# EasyEDA Pro project YiYiClock.eprj

# Schematic Schematic1
Create Date: 2024-08-25; Page Name: P1; Project Name: YiYiClock; Schematic Name: Schematic1; Update Date: 2024-08-25; Company: 嘉立创EDA; Page Size: A4; Version: V1.0
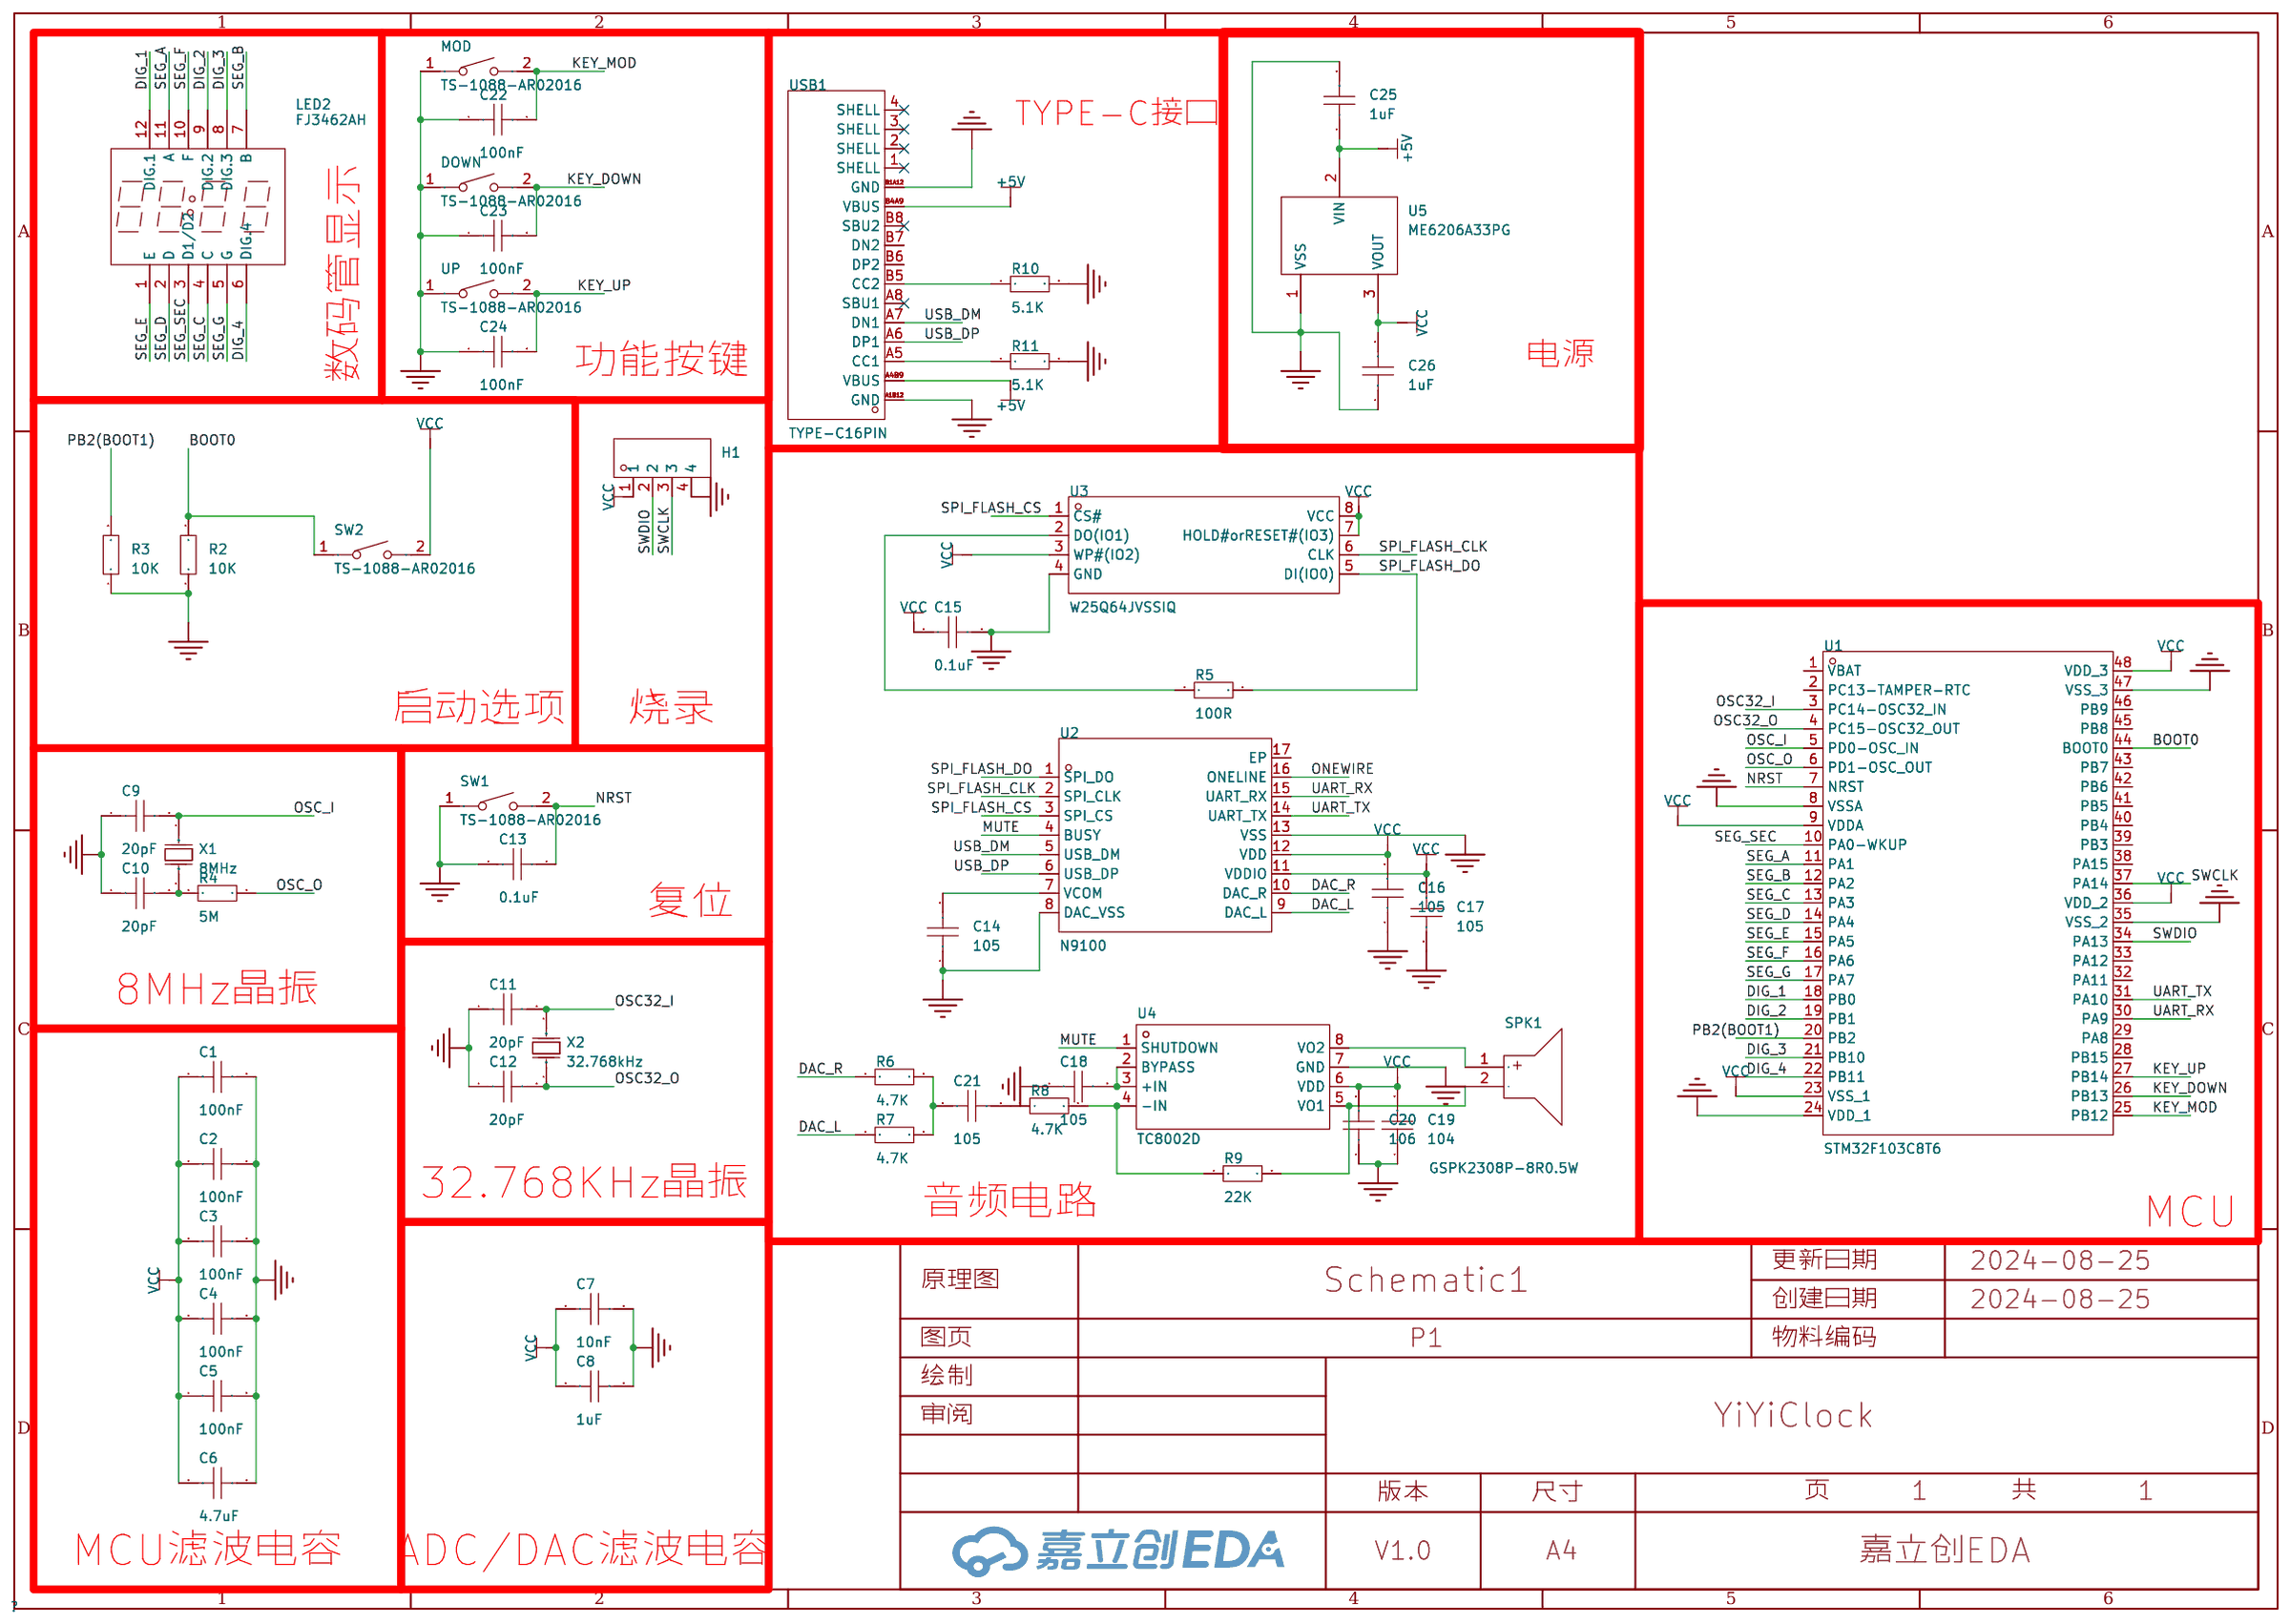
[diagram p0: schematic sheet]

## Parts
C1  100nF  [C0805]
C2  100nF  [C0805]
C3  100nF  [C0805]
C4  100nF  [C0805]
C5  100nF  [C0805]
C6  4.7uF  [C0805]
C7  10nF  [C0805]
C8  1uF  [C0805]
C9  20pF  [C0805]
C10  20pF  [C0805]
C11  20pF  [C0805]
C12  20pF  [C0805]
C13  0.1uF  [C0805]
C14  105  [C0805]
C15  0.1uF  [C0805]
C16  105  [C0805]
C17  105  [C0805]
C18  105  [C0805]
C19  104  [C0805]
C20  106  [C0805]
C21  105  [C0805]
C22  100nF  [C0805]
C23  100nF  [C0805]
C24  100nF  [C0805]
C25  1uF  [res-th_l7.5-w2.3-p4.30-d0.6]
C26  1uF  [res-th_l7.5-w2.3-p4.30-d0.6]
DOWN  TS-1088-AR02016  [SW-SMD_L3.9-W3.0-P4.45]
H1  -  [HDR-TH_4P-P2.54-V-M]
LED2  FJ3462AH  [LED-SEG-TH_12P-L30.0-W14.0-P2.54-S10.16-BL_FJ3462XH]
MOD  TS-1088-AR02016  [SW-SMD_L3.9-W3.0-P4.45]
R2  10K  [res-th_bd2.7-l6.2-p10.20-d0.4]
R3  10K  [res-th_bd2.7-l6.2-p10.20-d0.4]
R4  5M  [R0805]
R5  100R  [R0805]
R6  4.7K  [R0805]
R7  4.7K  [R0805]
R8  4.7K  [R0805]
R9  22K  [R0805]
R10  5.1K  [R0805]
R11  5.1K  [R0805]
SPK1  GSPK2308P-8R0.5W  [SPK-TH_BD23.0-P10.00-D0.8-L-RD]
SW1  TS-1088-AR02016  [SW-SMD_L3.9-W3.0-P4.45]
SW2  TS-1088-AR02016  [SW-SMD_L3.9-W3.0-P4.45]
U1  STM32F103C8T6  [LQFP-48_L7.0-W7.0-P0.50-LS9.0-BL]
U2  N9100  [ESOP-16_L9.9-W3.9-P1.27-LS6.0-BL-EP-1]
U3  W25Q64JVSSIQ  [SOIC-8_L5.3-W5.3-P1.27-LS8.0-BL]
U4  TC8002D  [SOIC-8_L5.0-W4.0-P1.27-LS6.0-BL]
U5  ME6206A33PG  [SOT-89-3_L4.5-W2.5-P1.50-LS4.2-BR]
UP  TS-1088-AR02016  [SW-SMD_L3.9-W3.0-P4.45]
USB1  TYPE-C16PIN  [USB-C-SMD_TYPE-C16PIN]
X1  8MHz  [CRYSTAL-SMD_L11.5-W4.8-LS12.7]
X2  32.768kHz  [OSC-SMD_L3.2-W1.5]

## Library data of the parts
C1-C24 = CAP_0805: Supplier Footprint: 0805
C25 C26 = CAP_0603: Supplier Footprint: 0603
DOWN MOD SW1 SW2 UP = TS-1088-AR02016: 电路结构:单刀单掷;按钮形状:圆形按钮;作用力:160gf;安装方式:立贴;开关长度:4mm;开关宽度:3mm;开关高度:2mm;带支架:不带;触点电流:50mA;额定电压(DC):12V;绝缘电阻:100MΩ;机械寿命:10万次;; LCSC Part Name: 4*3*2mm 立贴 轻触开关; Supplier Part: C720477; Manufacturer: XUNPU(讯普); Supplier Footprint: SMD; JLCPCB Part Class: 扩展库; Datasheet: https://atta.szlcsc.com/upload/public/pdf/source/20200810/C720475_60D09DD6C54279ADDB2DC25100F1CC11.pdf; Supplier: LCSC; Circuit: 单刀单掷; Actuator Style: 圆形按钮; Operating Force: 160gf; Mounting Style: 立贴; Switch Length: 4mm; Switch Width: 3mm; Switch Height: 2mm; Strike Gundam: 不带; Contact Current: 50mA; Voltage Rating (DC): 12V; Insulation Resistance: 100MΩ; Actuator/Cap Color: 黑色; Pin Style: SMD接片; Mechanical Life: 10万次; Operating Temperature: -30℃~+80℃
H1 = HDR-M_2.54_1x4P: Supplier Part: C492403; Supplier Footprint: 插件
LED2 = FJ3462AH: 发光颜色:-;; Supplier Part: C528072; Manufacturer: 志浩; Supplier Footprint: 插件; JLCPCB Part Class: 扩展库; Datasheet: https://atta.szlcsc.com/upload/public/pdf/source/20200714/C528072_875739C91E3D1B8CE3F89DB3AB3C45A9.pdf; Supplier: LCSC
R2 R3 = Res_0603: Supplier Footprint: 0603
R4-R11 = Res_0805: Supplier Footprint: 0805
SPK1 = GSPK2308P-8R0.5W: Supplier Part: C530532; Manufacturer: INGHAi(赢海); JLCPCB Part Class: 扩展库; Datasheet: https://atta.szlcsc.com/upload/public/pdf/source/20200723/C530532_3DB1F973601B36F20FBCCA52751811A3.pdf; Supplier: LCSC
U1 = STM32F103C8T6: CPU内核:ARM-M3;程序存储容量:64KB;RAM总容量:20KB;GPIO端口数量:37;工作电压范围:2V~3.6V;CPU最大主频:72MHz;程序存储器类型:FLASH;; LCSC Part Name: 主流增强型ARM Cortex-M3 MCU，具有64 KB Flash、72 MHz CPU、电机控制、USB和CAN; Supplier Part: C8734; Manufacturer: ST(意法半导体); Supplier Footprint: LQFP-48(7x7); JLCPCB Part Class: 扩展库; Datasheet: https://atta.szlcsc.com/upload/public/pdf/source/20220812/8363ACEC51AD55ECEB84799464F7CB85.pdf; Supplier: LCSC; CPU Core: ARM-M3; Program Storage Size: 64KB; RAM Size: 20KB; GPIO Ports Number: 37; Operating Voltage Range: 2V~3.6V; CPU Maximum Speed: 72MHz; Program Memory Type: FLASH; Operating Temperature Range: -40℃~+85℃; ADC (Bit): 12bit; Universal Serial Bus: 有; Peripheral/Function: 看门狗；DMA；看门狗；温度传感器; Watchdog: 有; Infrared Data Association: 有; Low-Voltage Detect: 有; Direct Memory Access: 有; Internal Oscillator: 有
U2 = N9100: 类型:处理器;接口:串行;采样频率:4kHz~48kHz;; LCSC Part Name: 音频解码芯片N9100; Supplier Part: C5186932; Manufacturer: NINE CIHP(九芯电子); Supplier Footprint: SOP-16-150mil; JLCPCB Part Class: 扩展库; Datasheet: https://atta.szlcsc.com/upload/public/pdf/source/20230313/ACBEE4CC81010E530B92D02B5D1A680A.pdf; Supplier: LCSC; Type: 处理器; Interface: 串行; Sampling Frequency: 4kHz~48kHz; Supply Voltage: 3V~5V; Operating Temperature: -20℃~+80℃
U3 = W25Q64JVSSIQ: Supplier Part: C179171; Manufacturer: WINBOND(华邦); Supplier Footprint: SOIC-8-208mil; JLCPCB Part Class: 扩展库; Datasheet: https://atta.szlcsc.com/upload/public/pdf/source/20191218/C179171_92C5C91D0324539EDD8F1160D2E79C0F.pdf; Supplier: LCSC
U4 = TC8002D: 功放类型:-;扬声器通道数:单声道;输出功率:3Wx1@3Ω;; Supplier Part: C87265; Manufacturer: FM(富满); Supplier Footprint: SOIC-8; JLCPCB Part Class: 扩展库; Datasheet: https://atta.szlcsc.com/upload/public/pdf/source/20161123/1479873101876.pdf; Supplier: LCSC; Speaker Channels: 单声道; Output Power: 3Wx1@3Ω; Supply Voltage: 2V~5.5V
U5 = ME6206A33PG: 输出类型:固定;最大输入电压:6V;输出电压:3.3V;最大输出电流:300mA;电源纹波抑制比(PSRR):50dB@(1kHz);输出极性:正极;; LCSC Part Name: 输入6V 输出3.3V 300mA; Supplier Part: C79022; Manufacturer: MICRONE(南京微盟); Supplier Footprint: SOT-89-3; JLCPCB Part Class: 扩展库; Datasheet: https://atta.szlcsc.com/upload/public/pdf/source/20160727/1469591428238.pdf; Supplier: LCSC; Output Type: 固定; Maximum Input Voltage: 6V; Output Voltage: 3.3V; MAX Output Current: 300mA; Power Supply Rejection Ratio (PSRR): 50dB@(1kHz); Dropout Voltage: 380mV@(200mA); Output Polarity: 正极; Number of Outputs: 1
USB1 = TYPE-C16PIN: 连接器类型:Type-C;标准:-;公母:母;端口数量:1;触点数量:16P;安装方式:卧贴;额定电流 - 电源:3A;工作温度范围:-40℃~+85℃;; LCSC Part Name: Type-C 母 卧贴; Supplier Part: C393939; Manufacturer: SHOU HAN(首韩); Supplier Footprint: SMD; JLCPCB Part Class: 扩展库; Datasheet: https://atta.szlcsc.com/upload/public/pdf/source/20190521/C393939_7B9043D4CF1026AF443AB60D91FBCD5C.pdf; Supplier: LCSC; Connector Type: Type-C; Gender: 母; Number of Ports: 1; Number of Contacts: 16P; Mounting Style: 卧贴; Current Rating - Power (Max): 3A; Operating Temperature Range: -40℃~+85℃
X1 = X49SM8MSD2SC: 晶振类型:贴片晶振;频率:8MHz;常温频差:±20ppm;外接负载电容:20pF;频率稳定度(全温):±30ppm;; LCSC Part Name: 8MHz ±20ppm 20pF; Supplier Part: C12674; Manufacturer: YXC(扬兴晶振); Supplier Footprint: HC-49S-SMD; JLCPCB Part Class: 基础库; Datasheet: https://atta.szlcsc.com/upload/public/pdf/source/20240329/3EBF42EBCAB50CA65B6FA9D7CFA1955A.pdf; Supplier: LCSC; Crystal Type: 贴片晶振; Normal temperature Frequency Tolerance: ±20ppm; External load capacitor: 20pF; Frequency Stability(Full temperature range): ±30ppm; Operating Temperature: -20℃~+70℃
X2 = TCXM32768K2NGDCZT2T: 晶振类型:贴片晶振;频率:32.768kHz;常温频差:±20ppm;外接负载电容:12.5pF;; LCSC Part Name: 32.768kHz ±20ppm 12.5pF; Supplier Part: C145167; Manufacturer: YJX(雅晶鑫); Supplier Footprint: SMD3215-2P; JLCPCB Part Class: 扩展库; Datasheet: https://atta.szlcsc.com/upload/public/pdf/source/20210824/1A405723E33C130357A85314F3997F53.pdf; Supplier: LCSC; Crystal Type: 贴片晶振; Normal temperature Frequency Tolerance: ±20ppm; External load capacitor: 12.5pF; Equivalent Series Resistance (ESR): 80kΩ; Operating Temperature: -40℃~+85℃

## Nets
+5V: C25.1 U5.2(VIN) USB1.A4B9(VBUS) USB1.B4A9(VBUS)
GND: C1.2 C2.2 C3.2 C4.2 C5.2 C6.2 C7.2 C8.2 C9.1 C10.1 C11.1 C12.1 C13.1 C14.1 C15.2 C16.1 C17.1 C18.1 C19.1 C20.1 C22.1 C23.1 C24.1 C25.2 C26.1 DOWN.1 H1.4 MOD.1 R2.1 R3.1 R10.2 R11.2 SW1.1 U1.8(VSSA) U1.24(VDD_1) U1.35(VSS_2) U1.47(VSS_3) U2.8(DAC_VSS) U2.13(VSS) U3.4(GND) U4.7(GND) U5.1(VSS) UP.1 USB1.A1B12(GND) USB1.B1A12(GND)
VCC: C1.1 C2.1 C3.1 C4.1 C5.1 C6.1 C7.1 C8.1 C15.1 C16.2 C17.2 C19.2 C20.2 C26.2 H1.1 SW2.2 U1.9(VDDA) U1.23(VSS_1) U1.36(VDD_2) U1.48(VDD_3) U2.11(VDDIO) U2.12(VDD) U3.3(WP#(IO2)) U3.7(HOLD#orRESET#(IO3)) U3.8(VCC) U4.6(VDD) U5.3(VOUT)
BOOT0: R2.2 SW2.1 U1.44(BOOT0)
DAC_L: R7.1 U2.9(DAC_L)
DAC_R: R6.1 U2.10(DAC_R)
DIG_1: LED2.12(DIG.1) U1.18(PB0)
DIG_2: LED2.9(DIG.2) U1.19(PB1)
DIG_3: LED2.8(DIG.3) U1.21(PB10)
DIG_4: LED2.6(DIG.4) U1.22(PB11)
KEY_DOWN: C23.2 DOWN.2 U1.26(PB13)
KEY_MOD: C22.2 MOD.2 U1.25(PB12)
KEY_UP: C24.2 U1.27(PB14) UP.2
MUTE: U2.4(BUSY) U4.1(SHUTDOWN)
NRST: C13.2 SW1.2 U1.7(NRST)
ONEWIRE: U2.16(ONELINE)
OSC32_I: C11.2 U1.3(PC14-OSC32_IN) X2.2(OSC2)
OSC32_O: C12.2 U1.4(PC15-OSC32_OUT) X2.1(OSC1)
OSC_I: C9.2 U1.5(PD0-OSC_IN) X1.1(OSC1)
OSC_O: R4.2 U1.6(PD1-OSC_OUT)
PB2(BOOT1): R3.2 U1.20(PB2)
SEG_A: LED2.11(A) U1.11(PA1)
SEG_B: LED2.7(B) U1.12(PA2)
SEG_C: LED2.4(C) U1.13(PA3)
SEG_D: LED2.2(D) U1.14(PA4)
SEG_E: LED2.1(E) U1.15(PA5)
SEG_F: LED2.10(F) U1.16(PA6)
SEG_G: LED2.5(G) U1.17(PA7)
SEG_SEC: LED2.3(D1/D2) U1.10(PA0-WKUP)
SPI_FLASH_CLK: U2.2(SPI_CLK) U3.6(CLK)
SPI_FLASH_CS: U2.3(SPI_CS) U3.1(CS#)
SPI_FLASH_DO: R5.2 U2.1(SPI_DO) U3.5(DI(IO0))
SWCLK: H1.3 U1.37(PA14)
SWDIO: H1.2 U1.34(PA13)
UART_RX: U1.30(PA9) U2.15(UART_RX)
UART_TX: U1.31(PA10) U2.14(UART_TX)
USB_DM: U2.5(USB_DM) USB1.A7(DN1)
USB_DP: U2.6(USB_DP) USB1.A6(DP1)
$1N1263: C10.2 R4.1 X1.2(OSC2)
$1N2404: C14.2 U2.7(VCOM)
$1N2703: R5.1 U3.2(DO(IO1))
$1N2909: C18.2 U4.2(BYPASS) U4.3(+IN)
$1N2993: SPK1.1(+) U4.8(VO2)
$1N3219: C21.1 R6.2 R7.2
$1N3294: C21.2 R8.1
$1N3349: R8.2 R9.1 U4.4(-IN)
$1N3354: R9.2 SPK1.2(-) U4.5(VO1)
$1N4394: R10.1 USB1.B5(CC2)
$1N4449: R11.1 USB1.A5(CC1)

Not connected (* = marked no-connect by the designer): U1 1(VBAT) 2(PC13-TAMPER-RTC) 28(PB15) 29(PA8) 32(PA11) 33(PA12) 38(PA15) 39(PB3) 40(PB4) 41(PB5) 42(PB6) 43(PB7) 45(PB8) 46(PB9); U2 17(EP); USB1 1(SHELL)* 2(SHELL)* 3(SHELL)* 4(SHELL)* A8(SBU1)* B6(DP2) B7(DN2) B8(SBU2)*

## Notes on the sheet
- TYPE-C接口
- 数码管显示
- 功能按键
- 电源
- 启动选项
- 烧录
- 复位
- 8MHz晶振
- 32.768KHz晶振
- 音频电路
- MCU
- MCU滤波电容
- ADC/DAC滤波电容

# Board PCB1
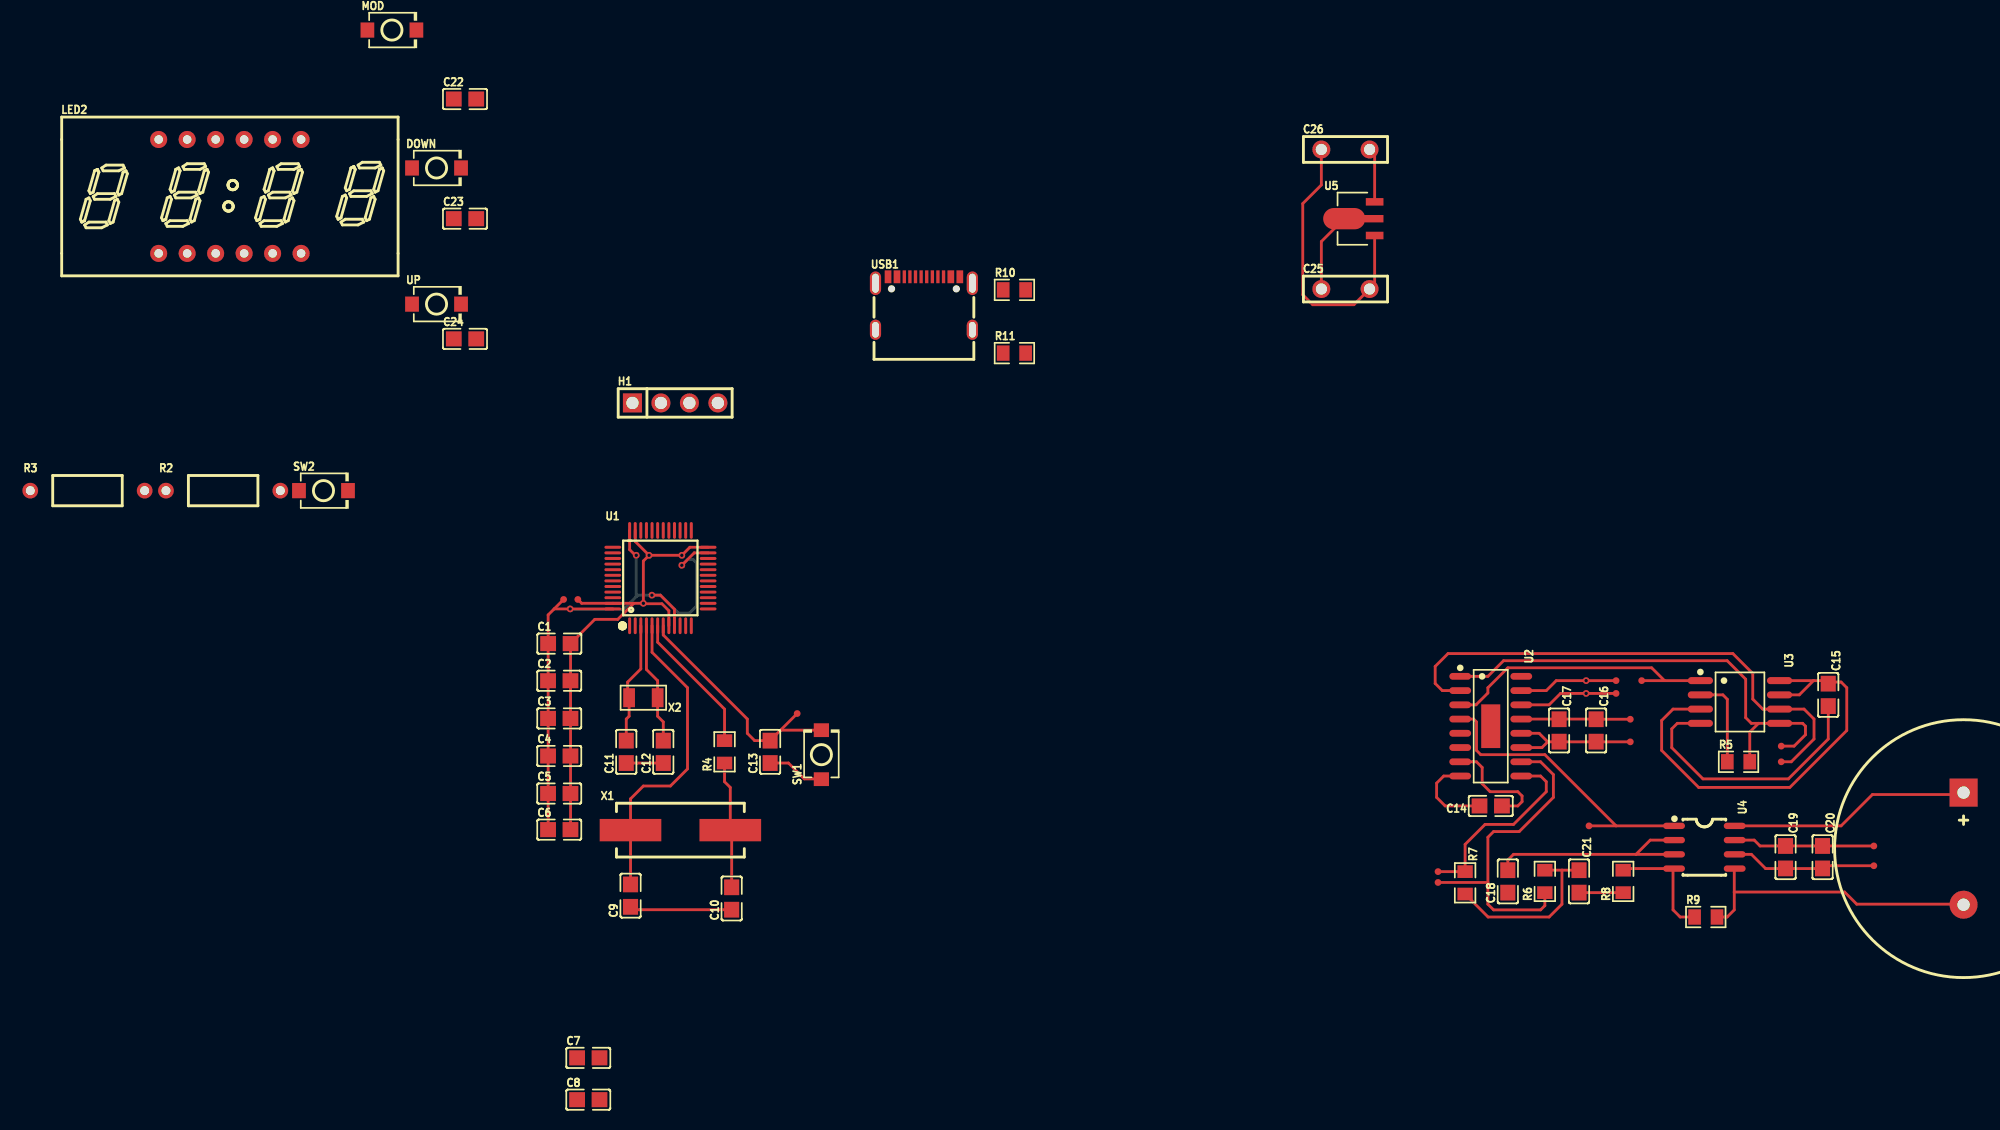
[diagram p1: board, top side]
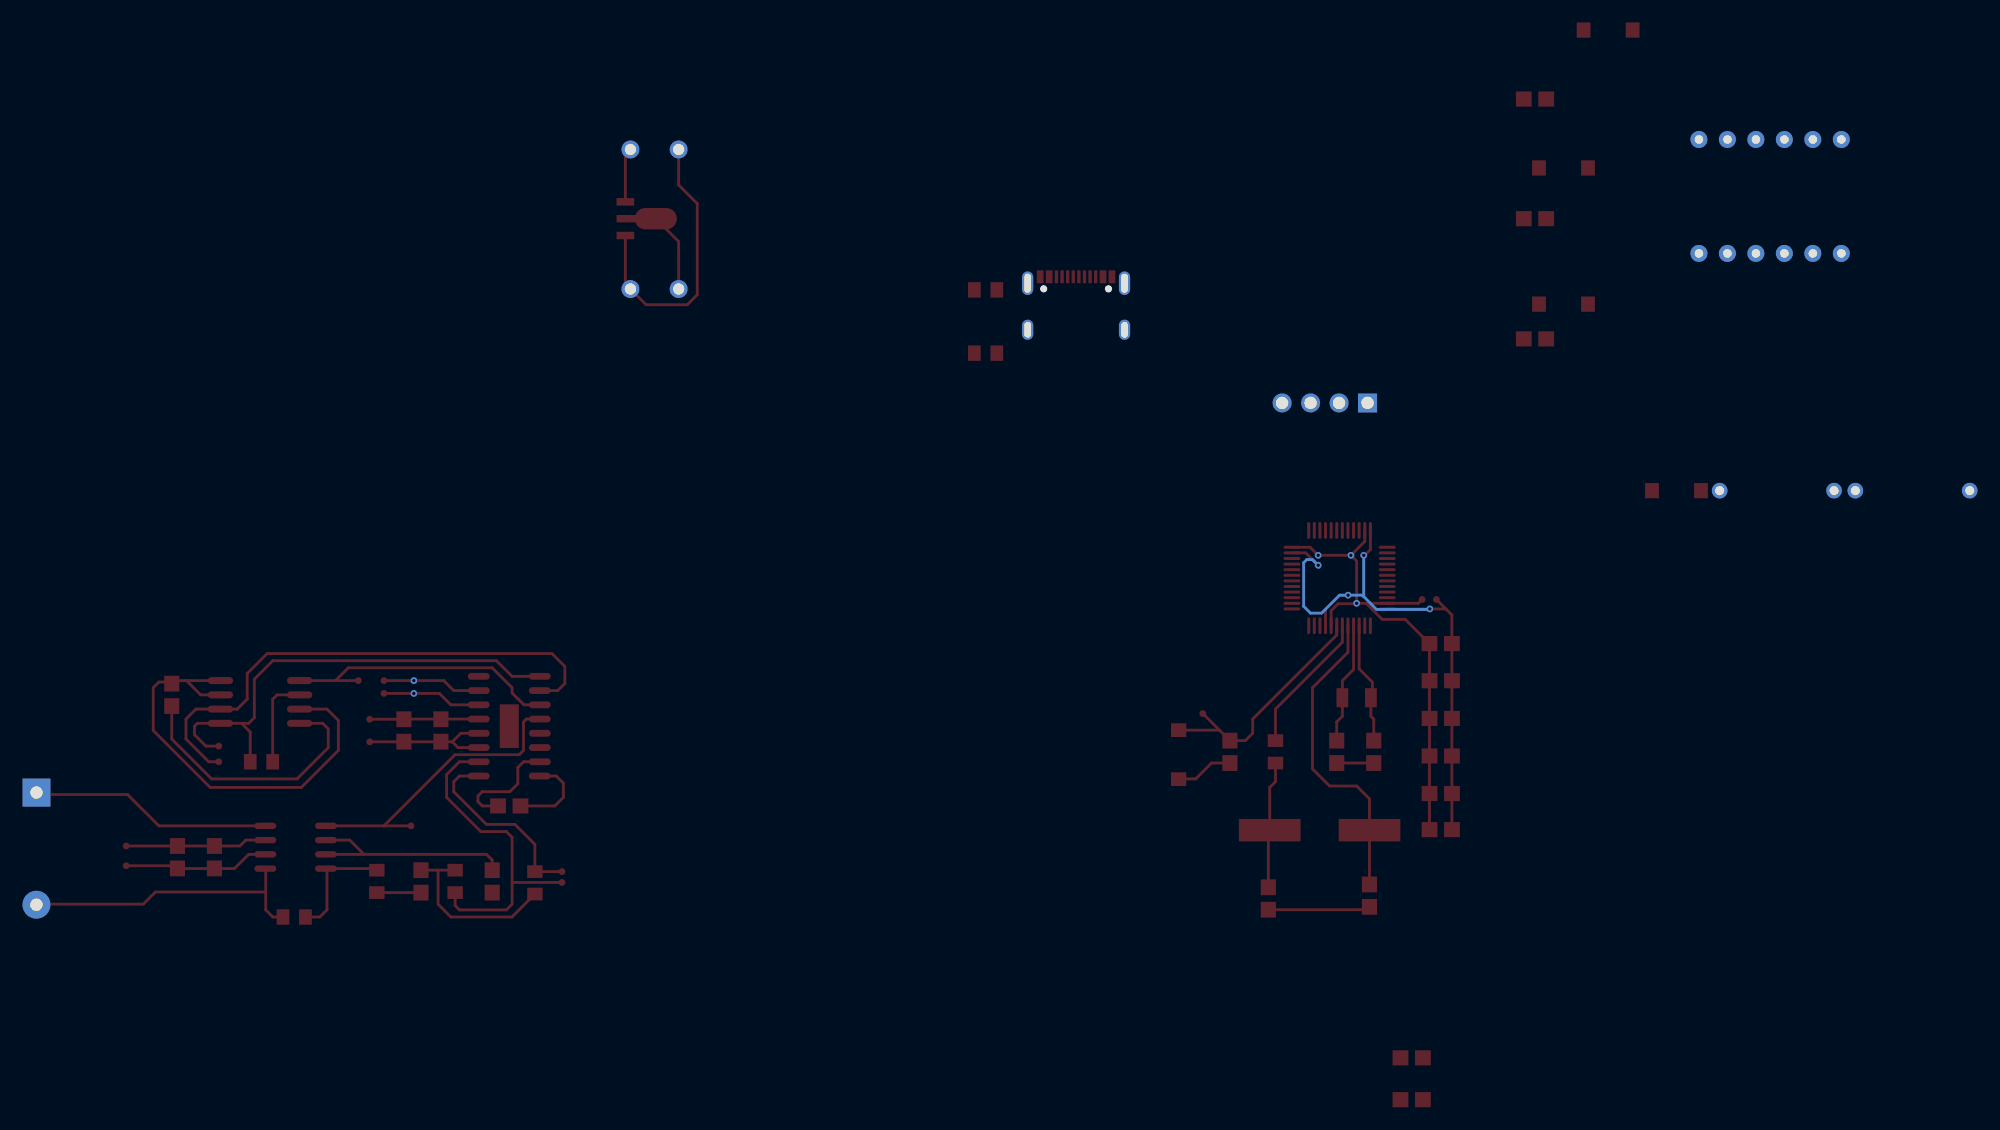
[diagram p2: board, bottom side, seen from below]

Outline 6.42 x 0.64 mm; copper layers: Top Layer, Bottom Layer. Coordinates in mm from the lower left corner of the outline.
Stack: Top Layer 0.035mm / Dielectric1 1.51mm FR4 er 4.5 / Bottom Layer 0.035mm

## Design rules (mm)
template: JLCPCB Capability(Two Layers Board)
spacing copperThickness1oz (default): track to track 0.102, other pairs 0.152 to 0.3
spacing copperThickness2oz: track to track 0.203, other pairs 0.152 to 0.3
track width copperThickness1oz (default): min 0.127, default 0.254, max 2.54
track width copperThickness2oz: min 0.203, default 0.254, max 2.54
differential pair differentialPair (default): width min 0.127, default 0.254, max 2.54; gap min 0.152, default 0.152
via viaSize (default): diameter min 0.5, default 0.61, max 10; hole min 0.3, default 0.305, max 6.3

## Placement (name value [footprint] x y rotation side)
C1  100nF  [C0805]  -29.3 -31.32 0 top
C2  100nF  [C0805]  -29.31 -34.63 0 top
C3  100nF  [C0805]  -29.31 -37.99 0 top
C4  100nF  [C0805]  -29.31 -41.34 0 top
C5  100nF  [C0805]  -29.31 -44.69 0 top
C6  4.7uF  [C0805]  -29.31 -47.91 0 top
C7  10nF  [C0805]  -26.72 -68.26 0 top
C8  1uF  [C0805]  -26.72 -71.99 0 top
C9  20pF  [C0805]  -22.95 -53.8 90 top
C10  20pF  [C0805]  -13.93 -54.05 90 top
C11  20pF  [C0805]  -23.33 -40.97 90 top
C12  20pF  [C0805]  -20.03 -40.97 90 top
C13  0.1uF  [C0805]  -10.5 -40.97 90 top
C14  105  [C0805]  53.76 -45.8 0 top
C15  0.1uF  [C0805]  83.86 -35.89 270 top
C16  105  [C0805]  63.16 -39.07 270 top
C17  105  [C0805]  59.85 -39.07 270 top
C18  105  [C0805]  55.28 -52.53 90 top
C19  104  [C0805]  80.05 -50.37 270 top
C20  106  [C0805]  83.35 -50.37 270 top
C21  105  [C0805]  61.63 -52.53 270 top
C22  100nF  [C0805]  -37.71 17.25 0 top
C23  100nF  [C0805]  -37.71 6.58 0 top
C24  100nF  [C0805]  -37.71 -4.14 0 top
C25  1uF  [res-th_l7.5-w2.3-p4.30-d0.6]  40.8 0.3 0 top
C26  1uF  [res-th_l7.5-w2.3-p4.30-d0.6]  40.8 12.75 0 top
DOWN  TS-1088-AR02016  [SW-SMD_L3.9-W3.0-P4.45]  -40.25 11.1 0 top
H1  -  [HDR-TH_4P-P2.54-V-M]  -18.97 -9.85 0 top
LED2  FJ3462AH  [LED-SEG-TH_12P-L30.0-W14.0-P2.54-S10.16-BL_FJ3462XH]  -58.68 8.56 0 top
MOD  TS-1088-AR02016  [SW-SMD_L3.9-W3.0-P4.45]  -44.23 23.4 0 top
NOREF  -  [Pad_e541]  62.52 -47.57 0 top
NOREF#2  -  [Pad_e490]  79.67 -41.86 0 top
NOREF#3  -  [Pad_e549]  49.06 -51.65 0 top
NOREF#4  -  [Pad_e465]  67.22 -34.62 0 top
NOREF#5  -  [Pad_e460]  66.2 -38.07 0 top
NOREF#6  -  [Pad_e687]  -28.92 -27.38 0 top
NOREF#7  -  [Pad_e683]  -27.65 -27.38 0 top
NOREF#8  -  [Pad_e645]  -8.09 -37.56 0 top
NOREF#9  -  [Pad_e461]  66.2 -40.08 0 top
NOREF#10  -  [Pad_e452]  64.93 -34.62 0 top
NOREF#11  -  [Pad_e489]  79.67 -40.46 0 top
NOREF#12  -  [Pad_e454]  64.93 -35.76 0 top
NOREF#13  -  [Pad_e505]  87.92 -49.37 0 top
NOREF#14  -  [Pad_e550]  49.06 -52.62 0 top
NOREF#15  -  [Pad_e506]  87.92 -51.13 0 top
R2  10K  [res-th_bd2.7-l6.2-p10.20-d0.4]  -59.28 -17.68 0 top
R3  10K  [res-th_bd2.7-l6.2-p10.20-d0.4]  -71.38 -17.68 0 top
R4  5M  [R0805]  -14.57 -40.97 90 top
R5  100R  [R0805]  75.86 -41.86 0 top
R6  4.7K  [R0805]  58.58 -52.53 90 top
R7  4.7K  [R0805]  51.47 -52.65 270 top
R8  4.7K  [R0805]  65.57 -52.53 90 top
R9  22K  [R0805]  72.94 -55.7 0 top
R10  5.1K  [R0805]  11.28 0.23 0 top
R11  5.1K  [R0805]  11.28 -5.41 0 top
SPK1  GSPK2308P-8R0.5W  [SPK-TH_BD23.0-P10.00-D0.8-L-RD]  95.92 -49.61 270 top
SW1  TS-1088-AR02016  [SW-SMD_L3.9-W3.0-P4.45]  -5.93 -41.22 90 top
SW2  TS-1088-AR02016  [SW-SMD_L3.9-W3.0-P4.45]  -50.33 -17.68 0 top
U1  STM32F103C8T6  [LQFP-48_L7.0-W7.0-P0.50-LS9.0-BL]  -20.28 -25.48 0 top
U2  N9100  [ESOP-16_L9.9-W3.9-P1.27-LS6.0-BL-EP-1]  53.76 -38.68 270 top
U3  W25Q64JVSSIQ  [SOIC-8_L5.3-W5.3-P1.27-LS8.0-BL]  75.98 -36.53 270 top
U4  TC8002D  [SOIC-8_L5.0-W4.0-P1.27-LS6.0-BL]  72.81 -49.48 270 top
U5  ME6206A33PG  [SOT-89-3_L4.5-W2.5-P1.50-LS4.2-BR]  42.05 6.58 0 top
UP  TS-1088-AR02016  [SW-SMD_L3.9-W3.0-P4.45]  -40.25 -1.04 0 top
USB1  TYPE-C16PIN  [USB-C-SMD_TYPE-C16PIN]  3.21 -0.97 0 top
X1  8MHz  [CRYSTAL-SMD_L11.5-W4.8-LS12.7]  -18.5 -47.96 0 top
X2  32.768kHz  [OSC-SMD_L3.2-W1.5]  -21.81 -36.14 180 top

## Footprints (pads in the part's own frame, mm; a bottom-side part is the same pattern mirrored in y, then rotated)
C0805
  rect 1.41x1.35 smd: 1(-1,0) 2(1,0)
CRYSTAL-SMD_L11.5-W4.8-LS12.7
  rect 5.5x2 smd: 1(-4.45,0) 2(4.45,0)
ESOP-16_L9.9-W3.9-P1.27-LS6.0-BL-EP-1
  oval 0.609x1.944 smd: 1(-4.445,-2.722) 2(-3.175,-2.722) 3(-1.905,-2.722) 4(-0.635,-2.722) 5(0.635,-2.722) 6(1.905,-2.722) 7(3.175,-2.722) 8(4.445,-2.722) 9(4.445,2.722) 10(3.175,2.722) 11(1.905,2.722) 12(0.635,2.722) 13(-0.635,2.722) 14(-1.905,2.722) 15(-3.175,2.722) 16(-4.445,2.722)
  rect 3.9x1.7 smd: 17(0,0)
HDR-TH_4P-P2.54-V-M
  rect 1.7x1.7 hole 1.1: 1(-3.81,0)
  round 1.7 hole 1.1: 2(-1.27,0) 3(1.27,0) 4(3.81,0)
LED-SEG-TH_12P-L30.0-W14.0-P2.54-S10.16-BL_FJ3462XH
  round 1.524 hole 0.762: 1(-6.35,-5.08) 2(-3.81,-5.08) 3(-1.27,-5.08) 4(1.27,-5.08) 5(3.81,-5.08) 6(6.35,-5.08) 7(6.35,5.08) 8(3.81,5.08) 9(1.27,5.08) 10(-1.27,5.08) 11(-3.81,5.08) 12(-6.35,5.08)
LQFP-48_L7.0-W7.0-P0.50-LS9.0-BL
  oval 0.27x1.5 smd: 1(-2.75,-4.25) 2(-2.25,-4.25) 3(-1.75,-4.25) 4(-1.25,-4.25) 5(-0.75,-4.25) 6(-0.25,-4.25) 7(0.25,-4.25) 8(0.75,-4.25) 9(1.25,-4.25) 10(1.75,-4.25) 11(2.25,-4.25) 12(2.75,-4.25) 25(2.75,4.25) 26(2.25,4.25) 27(1.75,4.25) 28(1.25,4.25) 29(0.75,4.25) 30(0.25,4.25) 31(-0.25,4.25) 32(-0.75,4.25) 33(-1.25,4.25) 34(-1.75,4.25) 35(-2.25,4.25) 36(-2.75,4.25)
  oval 1.5x0.27 smd: 13(4.25,-2.75) 14(4.25,-2.25) 15(4.25,-1.75) 16(4.25,-1.25) 17(4.25,-0.75) 18(4.25,-0.25) 19(4.25,0.25) 20(4.25,0.75) 21(4.25,1.25) 22(4.25,1.75) 23(4.25,2.25) 24(4.25,2.75) 37(-4.25,2.75) 38(-4.25,2.25) 39(-4.25,1.75) 40(-4.25,1.25) 41(-4.25,0.75) 42(-4.25,0.25) 43(-4.25,-0.25) 44(-4.25,-0.75) 45(-4.25,-1.25) 46(-4.25,-1.75) 47(-4.25,-2.25) 48(-4.25,-2.75)
OSC-SMD_L3.2-W1.5
  rect 1.05x1.7 smd: 1(-1.275,0) 2(1.275,0)
Pad_e452
  round 0.61 smd: TP1(0,0)
Pad_e454
  round 0.61 smd: TP3(0,0)
Pad_e460
  round 0.61 smd: TP5(0,0)
Pad_e461
  round 0.61 smd: TP6(0,0)
Pad_e465
  round 0.61 smd: TP8(0,0)
Pad_e489
  round 0.61 smd: TP13(0,0)
Pad_e490
  round 0.61 smd: TP14(0,0)
Pad_e505
  round 0.61 smd: TP16(0,0)
Pad_e506
  round 0.61 smd: TP17(0,0)
Pad_e541
  round 0.61 smd: TP19(0,0)
Pad_e549
  round 0.61 smd: TP21(0,0)
Pad_e550
  round 0.61 smd: TP22(0,0)
Pad_e645
  round 0.61 smd: TP24(0,0)
Pad_e683
  round 0.61 smd: TP28(0,0)
Pad_e687
  round 0.61 smd: TP30(0,0)
R0805
  rect 1.133x1.377 smd: 1(-1,0) 2(1,0)
res-th_bd2.7-l6.2-p10.20-d0.4
  round 1.4 hole 0.8: 1(-5.1,0) 2(5.1,0)
res-th_l7.5-w2.3-p4.30-d0.6
  round 1.6 hole 1: 1(-2.15,0) 2(2.15,0)
SOIC-8_L5.0-W4.0-P1.27-LS6.0-BL
  oval 0.569x1.95 smd: 1(-1.905,-2.705) 2(-0.635,-2.705) 3(0.635,-2.705) 4(1.905,-2.705) 5(1.905,2.705) 6(0.635,2.705) 7(-0.635,2.705) 8(-1.905,2.705)
SOIC-8_L5.3-W5.3-P1.27-LS8.0-BL
  oval 0.63x2.25 smd: 1(-1.905,-3.53) 2(-0.635,-3.53) 3(0.635,-3.53) 4(1.905,-3.53) 5(1.905,3.53) 6(0.635,3.53) 7(-0.635,3.53) 8(-1.905,3.53)
SOT-89-3_L4.5-W2.5-P1.50-LS4.2-BR
  rect 1.575x0.672 smd: 1(1.356,-1.5) 3(1.356,1.5)
  custom 5.377x1.9 smd: 2(-1.356,0)
SPK-TH_BD23.0-P10.00-D0.8-L-RD
  rect 2.5x2.5 hole 1.1: 1(-5,0)
  round 2.5 hole 1.1: 2(5,0)
SW-SMD_L3.9-W3.0-P4.45
  rect 1.23x1.36 smd: 1(-2.185,0) 2(2.185,0)
USB-C-SMD_TYPE-C16PIN
  oval 1x2.1 hole 0.6x1.7: 1(-4.32,1.788) 2(4.32,1.788)
  oval 1x1.8 hole 0.6x1.4: 3(-4.32,-2.362) 4(4.32,-2.362)
  rect 0.6x1.15 smd: A1B12(-3.2,2.362) A4B9(-2.4,2.362) B1A12(3.2,2.362) B4A9(2.4,2.362)
  rect 0.3x1.15 smd: A5(-1.25,2.362) A6(-0.25,2.362) A7(0.25,2.362) A8(-1.75,2.362) B5(1.75,2.362) B6(0.75,2.362) B7(-0.75,2.362) B8(1.25,2.362)

## Nets
+5V: C25.1 U5.2 USB1.A4B9 USB1.B4A9
GND: C1.2 C2.2 C3.2 C4.2 C5.2 C6.2 C7.2 C8.2 C9.1 C10.1 C11.1 C12.1 C13.1 C14.1 C15.2 C16.1 C17.1 C18.1 C19.1 C20.1 C22.1 C23.1 C24.1 C25.2 C26.1 DOWN.1 H1.4 MOD.1 NOREF#5.TP5 NOREF#7.TP28 NOREF#13.TP16 R2.1 R3.1 R10.2 R11.2 SW1.1 U1.8 U1.24 U1.35 U1.47 U2.8 U2.13 U3.4 U4.7 U5.1 UP.1 USB1.A1B12 USB1.B1A12
VCC: C1.1 C2.1 C3.1 C4.1 C5.1 C6.1 C7.1 C8.1 C15.1 C16.2 C17.2 C19.2 C20.2 C26.2 H1.1 NOREF#6.TP30 NOREF#9.TP6 NOREF#15.TP17 SW2.2 U1.9 U1.23 U1.36 U1.48 U2.11 U2.12 U3.3 U3.7 U3.8 U4.6 U5.3
BOOT0: R2.2 SW2.1 U1.44
DAC_L: NOREF#3.TP21 R7.1 U2.9
DAC_R: NOREF#14.TP22 R6.1 U2.10
DIG_1: LED2.12 U1.18
DIG_2: LED2.9 U1.19
DIG_3: LED2.8 U1.21
DIG_4: LED2.6 U1.22
KEY_DOWN: C23.2 DOWN.2 U1.26
KEY_MOD: C22.2 MOD.2 U1.25
KEY_UP: C24.2 U1.27 UP.2
MUTE: NOREF.TP19 U2.4 U4.1
NRST: C13.2 NOREF#8.TP24 SW1.2 U1.7
ONEWIRE: U2.16
OSC32_I: C11.2 U1.3 X2.2
OSC32_O: C12.2 U1.4 X2.1
OSC_I: C9.2 U1.5 X1.1
OSC_O: R4.2 U1.6
PB2(BOOT1): R3.2 U1.20
SEG_A: LED2.11 U1.11
SEG_B: LED2.7 U1.12
SEG_C: LED2.4 U1.13
SEG_D: LED2.2 U1.14
SEG_E: LED2.1 U1.15
SEG_F: LED2.10 U1.16
SEG_G: LED2.5 U1.17
SEG_SEC: LED2.3 U1.10
SPI_FLASH_CLK: NOREF#2.TP14 U2.2 U3.6
SPI_FLASH_CS: NOREF#4.TP8 U2.3 U3.1
SPI_FLASH_DO: NOREF#11.TP13 R5.2 U2.1 U3.5
SWCLK: H1.3 U1.37
SWDIO: H1.2 U1.34
UART_RX: NOREF#10.TP1 U1.30 U2.15
UART_TX: NOREF#12.TP3 U1.31 U2.14
USB_DM: U2.5 USB1.A7
USB_DP: U2.6 USB1.A6
$1N1263: C10.2 R4.1 X1.2
$1N2404: C14.2 U2.7
$1N2703: R5.1 U3.2
$1N2909: C18.2 U4.2 U4.3
$1N2993: SPK1.1 U4.8
$1N3219: C21.1 R6.2 R7.2
$1N3294: C21.2 R8.1
$1N3349: R8.2 R9.1 U4.4
$1N3354: R9.2 SPK1.2 U4.5
$1N4394: R10.1 USB1.B5
$1N4449: R11.1 USB1.A5

Pads without a net: U1 1 2 28 29 32 33 38 39 40 41 42 43 45 46; U2 17; USB1 1 2 3 4 A8 B6 B7 B8

## Via types
v1: diameter 0.61, hole 0.305, Top Layer to Bottom Layer, 9 vias

## Routing (per net, layer and track width the routed paths; a pad name or vN(x,y) marks a point on that pad's centre or on a via; arc(x,y) is an arc through that point)
+5V: length 7.1
  Top Layer w0.254: C25.1 38.65,4.54 U5.2
GND: length 143.6
  Top Layer w0.254: v1(-21.81,-27.73) -21.77,-27.76 -20.16,-27.76 -19.53,-28.39 U1.8 ; v1(-21.81,-27.73) -22.66,-27.73 ; v1(-21.81,-27.73) -21.81,-23.95 v1(-21.3,-23.44) ; U5.1 43.41,0.76 C25.2 41.56,-1.09 37.88,-1.09 36.99,-0.2 36.99,7.92 38.65,9.58 C26.1 ; C14.1 49.69,-45.8 48.93,-45.03 48.93,-43.76 49.57,-43.13 U2.8 ; U2.13 63.14,-38.05 C16.1 NOREF#5.TP5 ; C12.1 C11.1 ; -22.66,-27.73 -24.09,-29.16 -26.14,-29.16 C1.2 -28.3,-47.9 C6.2 ; -22.66,-27.73 U1.47 -27.3,-27.73 NOREF#7.TP28 ; U3.4 70.4,-38.43 69.9,-38.93 69.9,-40.6 72.68,-43.38 80.3,-43.38 83.86,-39.83 C15.2 ; NOREF#13.TP16 C20.1 C19.1 77.78,-49.37 77.25,-48.84 U4.7 ; SW1.1 -5.96,-43.38 -7.46,-43.38 -8.87,-41.97 C13.1 ; U1.24 -17.66,-22.73 v1(-18.38,-23.44) v1(-21.3,-23.44) ; v1(-21.3,-23.44) -22.53,-22.21 U1.35 ; C9.1 -22.7,-55.05 C10.1
VCC: length 128.4
  Top Layer w0.254: U5.3 43.41,12.3 C26.2 ; U2.11 58.33,-40.59 58.84,-40.08 ; 80.03,-51.38 83.33,-51.38 C20.2 83.59,-51.13 NOREF#15.TP17 ; 80.03,-51.38 78.27,-51.38 77,-50.11 U4.6 ; 80.03,-51.38 C19.2 ; 63.14,-40.08 NOREF#9.TP6 ; 63.14,-40.08 C16.2 ; 63.14,-40.08 58.84,-40.08 ; U1.48 v1(-28.33,-28.23) -29.76,-28.23 ; U3.7 81.27,-35.89 82.54,-34.62 ; U1.9 -19.03,-28.26 -20.29,-27 v1(-21.04,-27) ; 82.54,-34.62 83.59,-34.62 C15.1 84,-34.75 85,-34.75 85.51,-35.26 85.51,-39.07 80.43,-44.15 72.3,-44.15 69,-40.84 69,-38.18 70.01,-37.16 U3.3 ; 82.54,-34.62 U3.8 ; v1(-18.38,-24.33) -17.27,-23.23 U1.23 ; -29.76,-28.23 NOREF#6.TP30 ; -29.76,-28.23 -30.3,-28.76 C1.1 -30.3,-47.9 C6.1 ; v1(-22.44,-23.44) -22.52,-23.44 -23.03,-22.94 U1.36 ; 58.84,-40.08 58.08,-39.32 U2.12
  Bottom Layer w0.254: v1(-18.38,-24.33) -17.87,-23.83 -17.36,-23.83 -17.08,-24.11 -17.08,-27.99 -17.69,-28.6 -18.68,-28.6 -20.28,-27 v1(-21.04,-27) -22.31,-27 -22.44,-27.13 ; -22.44,-27.13 -23.58,-28.27 -28.29,-28.27 v1(-28.33,-28.23) ; -22.44,-27.13 v1(-22.44,-23.44)
DAC_L: length 17.4
  Top Layer w0.254: U2.9 58.2,-43.13 58.71,-43.64 58.71,-44.53 55.79,-47.45 53.25,-47.45 51.47,-49.23 R7.1 NOREF#3.TP21
DAC_R: length 29.7
  Top Layer w0.254: U2.10 58.2,-41.86 59.35,-43 59.35,-45.03 56.3,-48.08 54.01,-48.08 53.5,-48.59 53.5,-52.62 ; R6.1 58.58,-54.69 58.2,-55.07 54.01,-55.07 53.5,-54.56 53.5,-52.62 ; 53.5,-52.62 NOREF#14.TP22
MUTE: length 26.9
  Top Layer w0.254: U2.4 52.23,-38.05 52.49,-38.3 52.49,-40.84 52.87,-41.22 58.58,-41.22 64.93,-47.57 ; 64.93,-47.57 NOREF.TP19 ; 64.93,-47.57 U4.1
NRST: length 22.1
  Top Layer w0.254: -9.57,-39.04 NOREF#8.TP24 -8.09,-37.54 ; -9.57,-39.04 SW1.2 ; -9.57,-39.04 C13.2 -11.88,-39.97 -12.54,-39.32 -12.54,-38.05 -20.03,-30.55 U1.7
OSC32_I: length 10.8
  Top Layer w0.254: -23.21,-36.14 -23.21,-34.75 -22.03,-33.58 U1.3 ; C11.2 -23.33,-38.05 -23.08,-37.8 -23.08,-36.15 X2.2
OSC32_O: length 10.9
  Top Layer w0.254: C12.2 -20.03,-38.3 -20.54,-37.8 -20.54,-36.15 X2.1 -20.54,-36.14 -20.54,-34.62 -21.53,-33.62 U1.4
OSC_I: length 27.9
  Top Layer w0.254: C9.2 -22.95,-47.96 X1.1 -22.95,-47.95 -22.95,-45.16 -21.81,-44.02 -19.39,-44.02 -17.87,-42.49 -17.87,-35.26 -21.03,-32.09 U1.5
OSC_O: length 12.7
  Top Layer w0.254: R4.2 -14.57,-37.16 -20.53,-31.2 U1.6
SPI_FLASH_CLK: length 47.6
  Top Layer w0.254: U2.2 49.44,-35.51 48.81,-34.87 48.81,-33.35 49.95,-32.21 75.35,-32.21 77.13,-33.99 77.13,-36.27 78.02,-37.16 U3.6 81.7,-37.16 82.59,-38.05 82.59,-39.83 80.56,-41.86 NOREF#2.TP14
SPI_FLASH_CS: length 25.6
  Top Layer w0.254: 69.25,-34.62 68.11,-33.48 55.28,-33.48 53.5,-35.26 53.5,-35.72 52.45,-36.78 U2.3 ; 69.25,-34.62 U3.1 ; 69.25,-34.62 NOREF#4.TP8
SPI_FLASH_DO: length 42.9
  Top Layer w0.254: 77.63,-38.43 77,-38.43 76.49,-37.92 76.49,-34.49 74.84,-32.84 54.9,-32.84 53.5,-34.24 U2.1 ; 77.63,-38.43 U3.5 81.57,-38.43 81.83,-38.68 81.83,-39.45 80.81,-40.46 NOREF#11.TP13 ; 77.63,-38.43 76.86,-39.21 R5.2
UART_RX: length 8.8
  Top Layer w0.254: NOREF#10.TP1 v1(62.27,-34.62) 59.6,-34.62 58.71,-35.51 U2.15
UART_TX: length 8.9
  Top Layer w0.254: U2.14 58.97,-36.78 59.98,-35.76 v1(62.27,-35.76) NOREF#12.TP3
$1N1263: length 11.3
  Top Layer w0.254: C10.2 -13.93,-48.08 X1.2 -14.05,-44.15 -14.57,-43.64 R4.1
$1N2404: length 10.1
  Top Layer w0.254: U2.7 52.49,-41.86 53,-42.37 53,-43.82 53.7,-44.53 56.17,-44.53 56.55,-44.91 56.55,-45.42 56.17,-45.8 C14.2
$1N2703: length 8.1
  Top Layer w0.254: U3.2 74.46,-35.89 74.86,-36.29 R5.1
$1N2909: length 19.9
  Top Layer w0.254: 66.71,-50.11 55.79,-50.11 55.28,-50.62 C18.2 ; 66.71,-50.11 67.98,-48.84 U4.2 ; 66.71,-50.11 U4.3
$1N2993: length 21.6
  Top Layer w0.254: U4.8 85,-47.57 87.79,-44.78 95.75,-44.78 SPK1.1
$1N3219: length 16
  Top Layer w0.254: R7.2 53.52,-55.7 58.97,-55.7 60.11,-54.56 60.11,-51.53 60.12,-51.53 ; 60.12,-51.53 C21.1 ; 60.12,-51.53 R6.2
$1N3294: length 3.9
  Top Layer w0.254: R8.1 C21.2
$1N3349: length 10.5
  Top Layer w0.254: R9.1 70.65,-55.7 70.01,-55.07 70.01,-51.47 U4.4 65.71,-51.38 R8.2
$1N3354: length 26.4
  Top Layer w0.254: 75.48,-53.48 75.48,-51.42 U4.5 ; 75.48,-53.48 85.31,-53.48 86.4,-54.56 95.88,-54.56 SPK1.2 ; 75.48,-53.48 75.48,-55.07 74.84,-55.7 R9.2
